# EasyEDA schematic SCH_10edm_2026-03-11.json
TITLE: Sheet_1; REV: 1.0; Date: 2026-03-11; Sheet: 1/1; Drawn By: nayim.abdualla.12; Company: Your Company
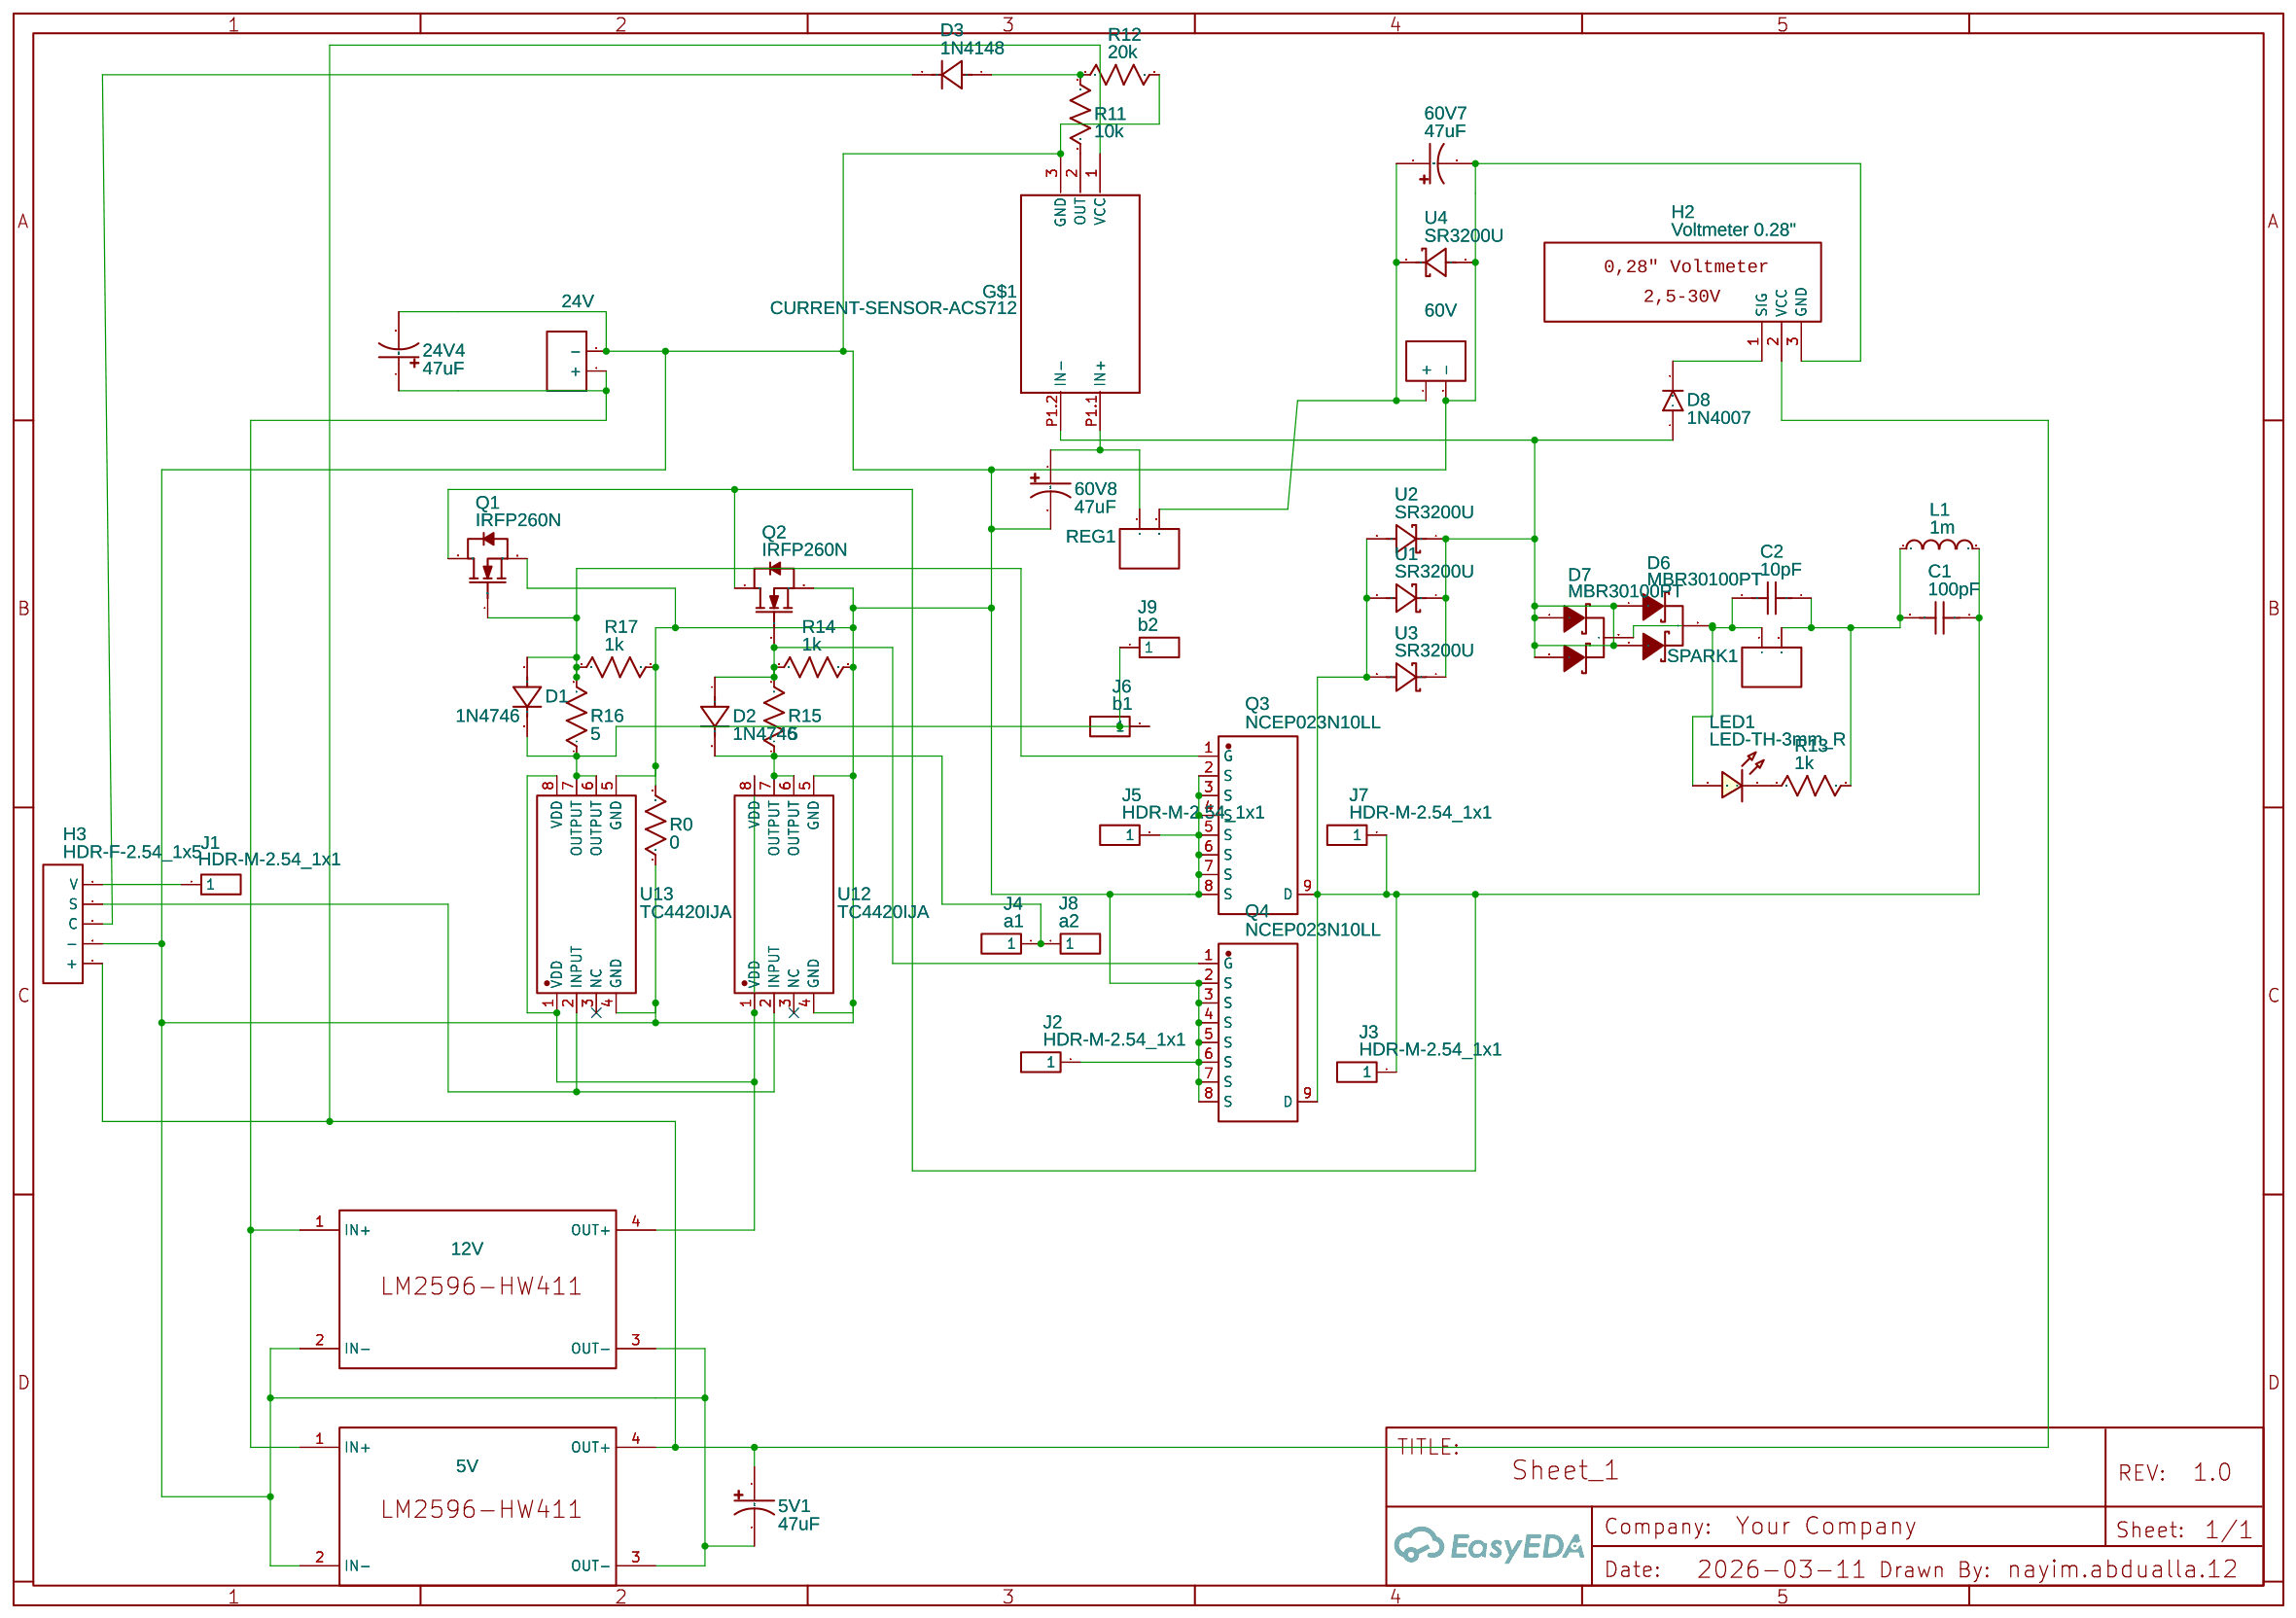
[diagram p0: schematic sheet]

## Parts
5V  LM2596-HW411  [LM2596 HW411]
5V1  47uF  [CAP-TH_BD10.0-P5.00-D1.0-FD]
12V  LM2596-HW411  [LM2596 HW411]
24V  CONN-TH_2P-P5.00  [CONN-TH_2P-P5.00]
24V4  47uF  [CAP-TH_BD10.0-P5.00-D1.0-FD]
60V  CONN-TH_2P-P5.00  [CONN-TH_2P-P5.00]
60V7  47uF  [CAP-TH_BD10.0-P5.00-D1.0-FD]
60V8  47uF  [CAP-TH_BD10.0-P5.00-D1.0-FD]
C1  100pF  [CAP-TH_L6.0-W3.0-P5.00-D1.0]
C2  10pF  [CAP-TH_L6.0-W3.0-P5.00-D1.0]
D1  1N4746  [DO-35_BD2.2-L4.0-D0.50_1N4148]
D2  1N4746  [DO-35_BD2.2-L4.0-D0.50_1N4148]
D3  1N4148  [DO-35_BD2.2-L4.0-D0.50_1N4148]
D6  MBR30100PT  [TO-247AC-3_L15.8-W5.0-P5.46-L]
D7  MBR30100PT  [TO-247AC-3_L15.8-W5.0-P5.46-L]
D8  1N4007  [D1N4007]
G$1  CURRENT-SENSOR-ACS712  [CURRENT-SENSOR-ACS712#IC]
H2  Voltmeter 0.28"  [VOLTMETER MODULE 0.28]
H3  HDR-F-2.54_1x5  [HDR-F-2.54_1X5]
J1  HDR-M-2.54_1x1  [HDR-M-2.54_1X1]
J2  HDR-M-2.54_1x1  [HDR-M-2.54_1X1]
J3  HDR-M-2.54_1x1  [HDR-M-2.54_1X1]
J4  a1  [HDR-M-2.54_1X1]
J5  HDR-M-2.54_1x1  [HDR-M-2.54_1X1]
J6  b1  [HDR-M-2.54_1X1]
J7  HDR-M-2.54_1x1  [HDR-M-2.54_1X1]
J8  a2  [HDR-M-2.54_1X1]
J9  b2  [HDR-M-2.54_1X1]
L1  1m  [L_AXIAL-0.6]
LED1  LED-TH-3mm_R  [LED-TH_BD3.0_RED]
Q1  IRFP260N  [TO-247-3_L21.0-W15.9-P5.44-L]
Q2  IRFP260N  [TO-247-3_L21.0-W15.9-P5.44-L]
Q3  NCEP023N10LL  [PG-HSOF-8-1_L10.4-W9.9-P1.2-LS11.7-TL]
Q4  NCEP023N10LL  [PG-HSOF-8-1_L10.4-W9.9-P1.2-LS11.7-TL]
R0  0  [R_AXIAL-0.4]
R11  10k  [R_AXIAL-0.4]
R12  20k  [R_AXIAL-0.4]
R13  1k  [R_AXIAL-0.4]
R14  1k  [R_AXIAL-0.4]
R15  5  [R_AXIAL-0.4]
R16  5  [R_AXIAL-0.4]
R17  1k  [R_AXIAL-0.4]
REG1  CONN-TH_2P-P5.00  [CONN-TH_2P-P5.00]
SPARK1  CONN-TH_2P-P5.00  [CONN-TH_2P-P5.00]
U1  SR3200U  [DO-201AD_BD5.3-L8.4-P12.50-D1.4-RD]
U2  SR3200U  [DO-201AD_BD5.3-L8.4-P12.50-D1.4-RD]
U3  SR3200U  [DO-201AD_BD5.3-L8.4-P12.50-D1.4-RD]
U4  SR3200U  [DO-201AD_BD5.3-L8.4-P12.50-D1.4-RD]
U12  TC4420IJA  [DIP-8_L9.7-W6.6-P2.54-LS7.6-BL]
U13  TC4420IJA  [DIP-8_L9.7-W6.6-P2.54-LS7.6-BL]

## Library data of the parts
5V 12V = LM2596-HW411: Supplier Part: LM2596 HW-411; Contributor: sanjay mengle
5V1 24V4 60V7 60V8 = NFK160VB47M10*16_3.5CC: Contributor: LCSC; Supplier: LCSC; Supplier Part: C346990; Manufacturer: SAMYOUNG(韩国三莹); Manufacturer Part: NFK160V47M10*16 3.5CC; JLCPCB Part Class: Extended Part
24V 60V REG1 SPARK1 = CONN-TH_2P-P5.00: Supplier: LCSC; Contributor: LCEDA_Lib
C1 C2 = R06B1B101KQ0T0S0N0: Contributor: LCSC; Supplier: LCSC; Supplier Part: C366820; Manufacturer: STE(松田); JLCPCB Part Class: Extended Part
D1 D2 = 1N4148_C18195411: Supplier: LCSC; Supplier Part: C18195411; Manufacturer: LJ(朗捷); Manufacturer Part: 1N4148; JLCPCB Part Class: Extended Part; Contributor: lcsc
D3 = 1N4148_C18195411: Supplier: LCSC; Supplier Part: C18195411; Manufacturer: LJ(朗捷); JLCPCB Part Class: Extended Part; Contributor: lcsc
D6 D7 = MBR30100PT: Supplier: LCSC; Manufacturer: PANJIT; Supplier Part: C49299; link: https://lcsc.com/eda_search?q=C49299&%26type=1&ref=editor; Contributor: rutorx
D8 = 1N4007: Supplier: LCSC; Manufacturer: STARSEA; Contributor: Malexsys; Supplier Part: C84641
G$1 = CURRENT-SENSOR-ACS712: Contributor: pmkorp
H2 = Voltmeter 0.28": Contributor: vlrm.prjct
H3 = HDR-F-2.54_1x5: Supplier Part: C50950; Supplier: LCSC; Contributor: LCEDA_Lib
J1-J9 = HDR-M-2.54_1x1: Supplier Part: C81276; Supplier: LCSC; Contributor: LCEDA_Lib
L1 = L_AXIAL-0.6_US: Contributor: LCEDA_Lib
LED1 = LED-TH-3mm_R: Manufacturer: EVERLIGHT(台湾亿光); Manufacturer Part: 204-10SDRD/S530-A3-L; Supplier Part: C84774; Supplier: LCSC; Contributor: LCEDA_Lib
Q1 Q2 = IRFP260N: Supplier: LCSC; Supplier Part: C33129608; Manufacturer: minos(迈诺斯); Contributor: lcsc; JLCPCB Part Class: Extended Part
Q3 Q4 = NCEP023N10LL: Contributor: LCSC; Supplier: LCSC; Supplier Part: C2686686; Manufacturer: NCE(无锡新洁能); JLCPCB Part Class: Extended Part
R0 R11-R17 = R_AXIAL-0.4_US: Contributor: LCEDA_Lib
U1-U4 = SR3200U: Contributor: lcsc; Supplier: LCSC; Supplier Part: C3033518; Manufacturer: DIYI(迪一/芯诺); JLCPCB Part Class: Extended Part
U12 U13 = TC4420IJA: Contributor: lcsc; Supplier: LCSC; Supplier Part: C641051; Manufacturer: MICROCHIP(美国微芯); JLCPCB Part Class: Extended Part

## Nets
Net-(5V-1): 5V.1(IN+) 12V.1(IN+) 24V.1(+) 24V4.1
Net-(5V-2): 5V.2(IN-) 5V.3(OUT-) 5V1.2 12V.2(IN-) 12V.3(OUT-) 24V.2(-) 24V4.2 60V.2(-) 60V7.2 60V8.2 G$1.3(GND) H2.3(GND) H3.2(-) J2.1 J5.1 Q1.3(S) Q2.3(S) Q3.2(S) Q3.3(S) Q3.4(S) Q3.5(S) Q3.6(S) Q3.7(S) Q3.8(S) Q4.2(S) Q4.3(S) Q4.4(S) Q4.5(S) Q4.6(S) Q4.7(S) Q4.8(S) R0.1 R0.2 R12.2 R14.2 R17.2 U4.2(A) U12.4(GND) U12.5(GND) U13.4(GND) U13.5(GND)
Net-(5V-4): 5V.4(OUT+) 5V1.1 G$1.1(VCC) H2.2(VCC) H3.1(+)
Net-(12V-4): 12V.4(OUT+) U12.1(VDD) U12.8(VDD) U13.1(VDD) U13.8(VDD)
Net-(60V8-1): 60V8.1 G$1.P1.1(IN+) REG1.1
Net-(60V-1): 60V.1(+) 60V7.1 REG1.2 U4.1
Net-(C1-1): C1.1 J3.1 J7.1 L1.2 Q1.2(D) Q2.2(D) Q3.9(D) Q4.9(D) U1.2(A) U2.2(A) U3.2(A)
Net-(C1-2): C1.2 C2.1 L1.1 R13.1 SPARK1.2
Net-(C2-2): C2.2 D6.2(K) D7.2(K) LED1.1 SPARK1.1
Net-(D1-1): D1.1(A) Q1.1(G) Q3.1(G) R16.2 R17.1
Net-(D1-2): D1.2(C) J6.1 J9.1 R16.1 U13.6(OUTPUT) U13.7(OUTPUT)
Net-(D2-1): D2.1(A) Q2.1(G) Q4.1(G) R14.1 R15.2
Net-(D2-2): D2.2(C) J4.1 J8.1 R15.1 U12.6(OUTPUT) U12.7(OUTPUT)
Net-(D3-1): D3.1(A) R11.2 R12.1
Net-(D3-2): D3.2(C) H3.3(C)
Net-(D6-1): D6.1(A) D6.3(A) D7.1(A) D7.3(A) D8.1(A) G$1.P1.2(IN-) U1.1 U2.1 U3.1
Net-(D8-2): D8.2(C) H2.1(SIG)
Net-(G$1-2): G$1.2(OUT) R11.1
Net-(H3-4): H3.4(S) U12.2(INPUT) U13.2(INPUT)
Net-(H3-5): H3.5(V) J1.1
Net-(LED1-2): LED1.2 R13.2

Not connected (* = marked no-connect by the designer): U12 3(NC)*; U13 3(NC)*
